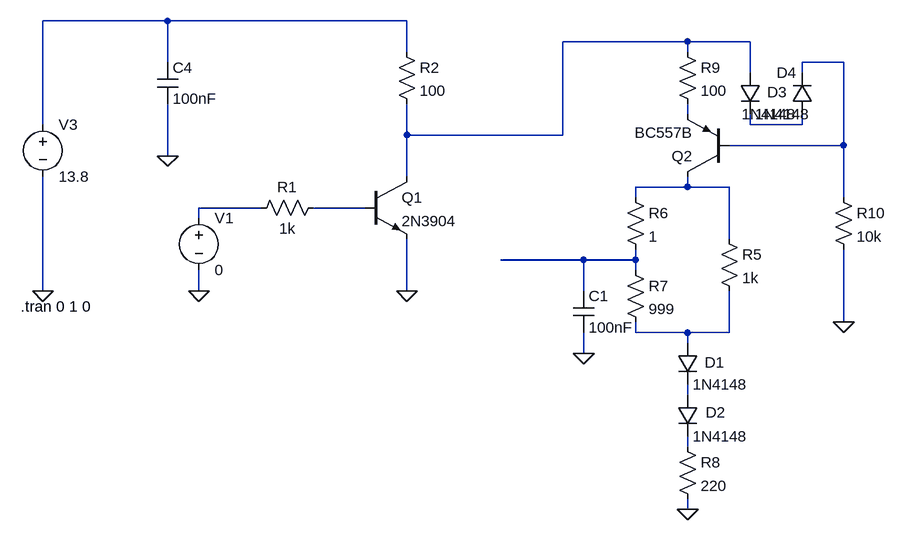
[diagram p0: schematic VGG.asc]
VGG.asc, the LTspice schematic file:
Version 4
SHEET 1 1828 1816
WIRE -2144 -944 -2336 -944
WIRE -1776 -944 -2144 -944
WIRE -1344 -912 -1536 -912
WIRE -1248 -912 -1344 -912
WIRE -1776 -896 -1776 -944
WIRE -1344 -896 -1344 -912
WIRE -2144 -880 -2144 -944
WIRE -1104 -880 -1168 -880
WIRE -1248 -864 -1248 -912
WIRE -1168 -864 -1168 -880
WIRE -1344 -800 -1344 -816
WIRE -2336 -784 -2336 -944
WIRE -1248 -784 -1248 -800
WIRE -1168 -784 -1168 -800
WIRE -1168 -784 -1248 -784
WIRE -1776 -768 -1776 -816
WIRE -1536 -768 -1536 -912
WIRE -1536 -768 -1776 -768
WIRE -1104 -752 -1104 -880
WIRE -1104 -752 -1280 -752
WIRE -2144 -736 -2144 -816
WIRE -1776 -704 -1776 -768
WIRE -1344 -688 -1344 -704
WIRE -1344 -688 -1424 -688
WIRE -1280 -688 -1344 -688
WIRE -1424 -672 -1424 -688
WIRE -1104 -672 -1104 -752
WIRE -2000 -656 -2096 -656
WIRE -1840 -656 -1920 -656
WIRE -2096 -640 -2096 -656
WIRE -1280 -608 -1280 -688
WIRE -1504 -576 -1632 -576
WIRE -1424 -576 -1424 -592
WIRE -1424 -576 -1504 -576
WIRE -1424 -560 -1424 -576
WIRE -2336 -528 -2336 -704
WIRE -2096 -528 -2096 -560
WIRE -1776 -528 -1776 -608
WIRE -1504 -528 -1504 -576
WIRE -1104 -480 -1104 -592
WIRE -1424 -464 -1424 -480
WIRE -1344 -464 -1424 -464
WIRE -1280 -464 -1280 -528
WIRE -1280 -464 -1344 -464
WIRE -1344 -448 -1344 -464
WIRE -1504 -432 -1504 -464
WIRE -1344 -368 -1344 -384
WIRE -1344 -288 -1344 -304
WIRE -1344 -192 -1344 -208
FLAG -2336 -528 0
FLAG -2144 -736 0
FLAG -1776 -528 0
FLAG -2096 -528 0
FLAG -1344 -192 0
FLAG -1504 -432 0
FLAG -1104 -480 0
SYMBOL voltage -2336 -800 R0
WINDOW 123 0 0 Left 2
WINDOW 39 0 0 Left 2
SYMATTR InstName V3
SYMATTR Value 13.8
SYMBOL cap -2160 -880 R0
SYMATTR InstName C4
SYMATTR Value 100nF
SYMBOL npn -1840 -704 R0
SYMATTR InstName Q1
SYMATTR Value 2N3904
SYMBOL res -1904 -672 R90
WINDOW 0 0 56 VBottom 2
WINDOW 3 32 56 VTop 2
SYMATTR InstName R1
SYMATTR Value 1k
SYMBOL res -1792 -912 R0
SYMATTR InstName R2
SYMATTR Value 100
SYMBOL voltage -2096 -656 R0
WINDOW 123 0 0 Left 2
WINDOW 39 0 0 Left 2
SYMATTR InstName V1
SYMATTR Value 0
SYMBOL diode -1360 -448 R0
WINDOW 0 42 30 Left 2
SYMATTR InstName D1
SYMATTR Value 1N4148
SYMBOL pnp -1280 -704 R180
SYMATTR InstName Q2
SYMATTR Value BC557B
SYMBOL res -1296 -624 R0
SYMATTR InstName R5
SYMATTR Value 1k
SYMBOL res -1440 -688 R0
SYMATTR InstName R6
SYMATTR Value 1
SYMBOL res -1440 -576 R0
SYMATTR InstName R7
SYMATTR Value 999
SYMBOL diode -1360 -368 R0
WINDOW 0 44 27 Left 2
SYMATTR InstName D2
SYMATTR Value 1N4148
SYMBOL res -1360 -304 R0
SYMATTR InstName R8
SYMATTR Value 220
SYMBOL cap -1520 -528 R0
SYMATTR InstName C1
SYMATTR Value 100nF
SYMBOL res -1360 -912 R0
SYMATTR InstName R9
SYMATTR Value 100
SYMBOL diode -1264 -864 R0
WINDOW 0 42 30 Left 2
SYMATTR InstName D3
SYMATTR Value 1N4148
SYMBOL diode -1152 -800 R180
WINDOW 0 24 64 Left 2
WINDOW 3 24 0 Left 2
SYMATTR InstName D4
SYMATTR Value 1N4148
SYMBOL res -1120 -688 R0
SYMATTR InstName R10
SYMATTR Value 10k
TEXT -2370 -504 Left 2 !.tran 0 1 0

The netlist it stands for:
* VGG.asc
V3 N001 0 13.8
C4 N001 0 100nF
Q1 N002 N008 0 0 2N3904
R1 N008 N007 1k
R2 N001 N002 100
V1 N007 0 0
D1 N010 N011 1N4148
Q2 N006 N003 N004 0 BC557B
R5 N006 N010 1k
R6 N006 N009 1
R7 N009 N010 999
D2 N011 N012 1N4148
R8 N012 0 220
C1 N009 0 100nF
R9 N002 N004 100
D3 N002 N005 1N4148
D4 N005 N003 1N4148
R10 N003 0 10k
.model D D
.lib standard.dio
.model NPN NPN
.model PNP PNP
.lib standard.bjt
.tran 0 1 0
.backanno
.end